# Altium schematic sheet SRS.SchDoc
size A4
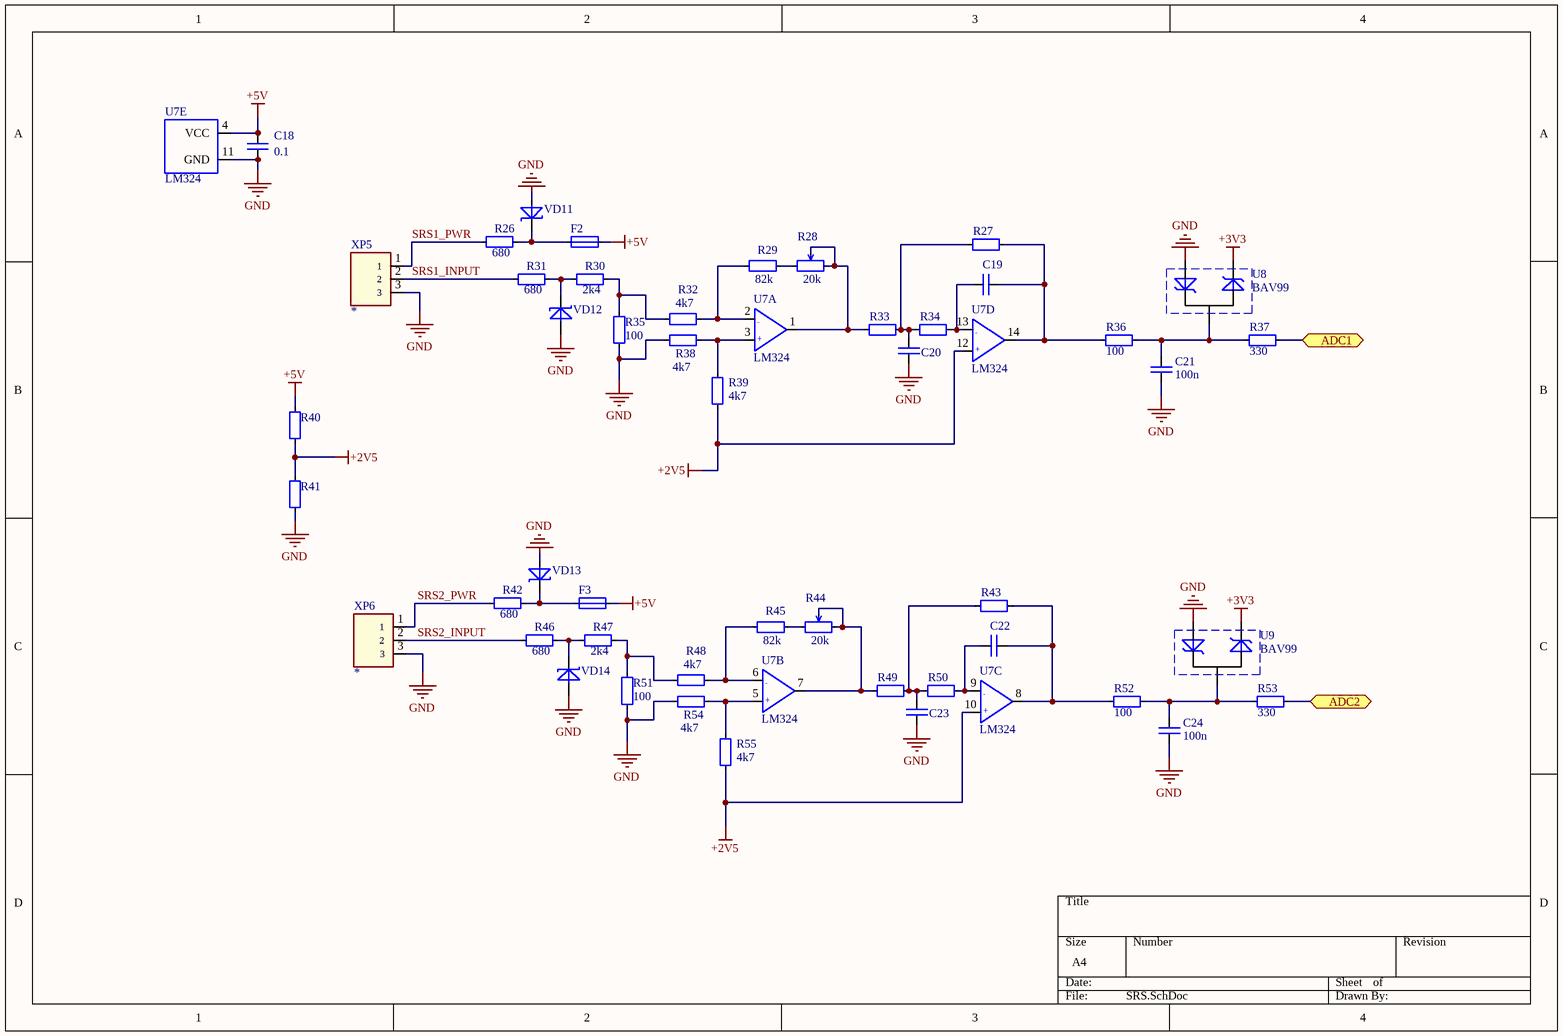
[diagram p0: SRS.SchDoc]

## Parts
C18  0.1  [SMD_0805]
C19  (no value)  [SMD_0805]
C20  (no value)  [SMD_0805]
C21  100n  [SMD_0805]
C22  (no value)  [SMD_0805]
C23  (no value)  [SMD_0805]
C24  100n  [SMD_0805]
F2  (no value)  [SMD_1206]
F3  (no value)  [SMD_1206]
R26  680  [SMD_0805]
R27  (no value)  [SMD_0805]
R28  20k  [RES-ADJ-SMD-Panasonic]
R29  82k  [SMD_0805]
R30  2k4  [SMD_0805]
R31  680  [SMD_0805]
R32  4k7  [SMD_0805]
R33  (no value)  [SMD_0805]
R34  (no value)  [SMD_0805]
R35  100  [SMD_0805]
R36  100  [SMD_0805]
R37  330  [SMD_0805]
R38  4k7  [SMD_0805]
R39  4k7  [SMD_0805]
R40  (no value)  [SMD_0805]
R41  (no value)  [SMD_0805]
R42  680  [SMD_0805]
R43  (no value)  [SMD_0805]
R44  20k  [RES-ADJ-SMD-Panasonic]
R45  82k  [SMD_0805]
R46  680  [SMD_0805]
R47  2k4  [SMD_0805]
R48  4k7  [SMD_0805]
R49  (no value)  [SMD_0805]
R50  (no value)  [SMD_0805]
R51  100  [SMD_0805]
R52  100  [SMD_0805]
R53  330  [SMD_0805]
R54  4k7  [SMD_0805]
R55  4k7  [SMD_0805]
U7  LM324  [SOIC-14]  (parts A,B,C,D,E of 5)
U8  BAV99  [SOT23-3]
U9  BAV99  [SOT23-3]
VD11  (no value)  [DO214-AC]
VD12  (no value)  [DO214-AC]
VD13  (no value)  [DO214-AC]
VD14  (no value)  [DO214-AC]
XP5  *  [MW-3M-2.0]
XP6  *  [MW-3M-2.0]

## Ports
ADC1, ADC2

## Nets
+2V5: R39.2 R40.1 R41.2 R55.2 U7.10(IN3+) U7.12(IN4+)
+3V3: U8.2 U9.2
+5V: C18.2 F2.1 F3.1 R40.2 U7.4(VCC)
GND: C18.1 C20.2 C21.2 C23.2 C24.2 R35.2 R38.1 R41.1 R51.2 R54.1 U7.11(GND) U8.1 U9.1 VD11.2(A) VD12.2(A) VD13.2(A) VD14.2(A) XP5.3 XP6.3
ADC1: R37.2 ; port ADC1
ADC2: R53.2 ; port ADC2
SRS1_INPUT: R31.2 XP5.2
SRS1_PWR: R26.2 XP5.1
SRS2_INPUT: R46.2 XP6.2
SRS2_PWR: R42.2 XP6.1
NetC19_1: C19.1 R34.1 U7.13(IN4-)
NetC19_2: C19.2 R27.1 R36.1 U7.14(OUT4)
NetC20_1: C20.1 R27.2 R33.1 R34.2
NetC21_1: C21.1 R36.2 R37.1 U8.3
NetC22_1: C22.1 R50.1 U7.9(IN3-)
NetC22_2: C22.2 R43.1 R52.1 U7.8(OUT3)
NetC23_1: C23.1 R43.2 R49.1 R50.2
NetC24_1: C24.1 R52.2 R53.1 U9.3
NetF2_2: F2.2 R26.1 VD11.1(C)
NetF3_2: F3.2 R42.1 VD13.1(C)
NetR28_1: R28.1 R29.1
NetR28_2: R28.2 R28.3 R33.2 U7.1(OUT1)
NetR29_2: R29.2 R32.1 U7.2(IN1-)
NetR30_1: R30.1 R32.2 R35.1
NetR30_2: R30.2 R31.1 VD12.1(C)
NetR38_2: R38.2 R39.1 U7.3(IN1+)
NetR44_1: R44.1 R45.1
NetR44_2: R44.2 R44.3 R49.2 U7.7(OUT2)
NetR45_2: R45.2 R48.1 U7.6(IN2-)
NetR46_1: R46.1 R47.2 VD14.1(C)
NetR47_1: R47.1 R48.2 R51.1
NetR54_2: R54.2 R55.1 U7.5(IN2+)

## Notes on the sheet
- (in symbol LM324, part A) -; +
- (in symbol LM324, part B) -; +
- (in symbol LM324, part C) -; +
- (in symbol LM324, part D) -; +

## Library data of the parts
C18-C24 = C_NONE_POLAR: None polar capacitor; Case: *
  C18: Value: 0.1
  C21 C24: Value: 100n
F2 F3 = FUSE: Resistor; Case: 1206
R26 R27 R29-R43 R45-R55 = RES: Resistor; Case: *
  R26 R31 R42 R46: Value: 680
  R29 R45: Value: 82k
  R30 R47: Value: 2k4
  R32 R38 R39 R48 R54 R55: Value: 4k7
  R35 R36 R51 R52: Value: 100
  R37 R53: Value: 330
R28 R44 = RES_ADJ: Agjustable resistor; Value: 20k
U7 = LM324: OpAmp
U8 U9 = BAV99: TVS diodes
VD11-VD14 = ZENER: Zener diode
XP5 XP6 = CON_3